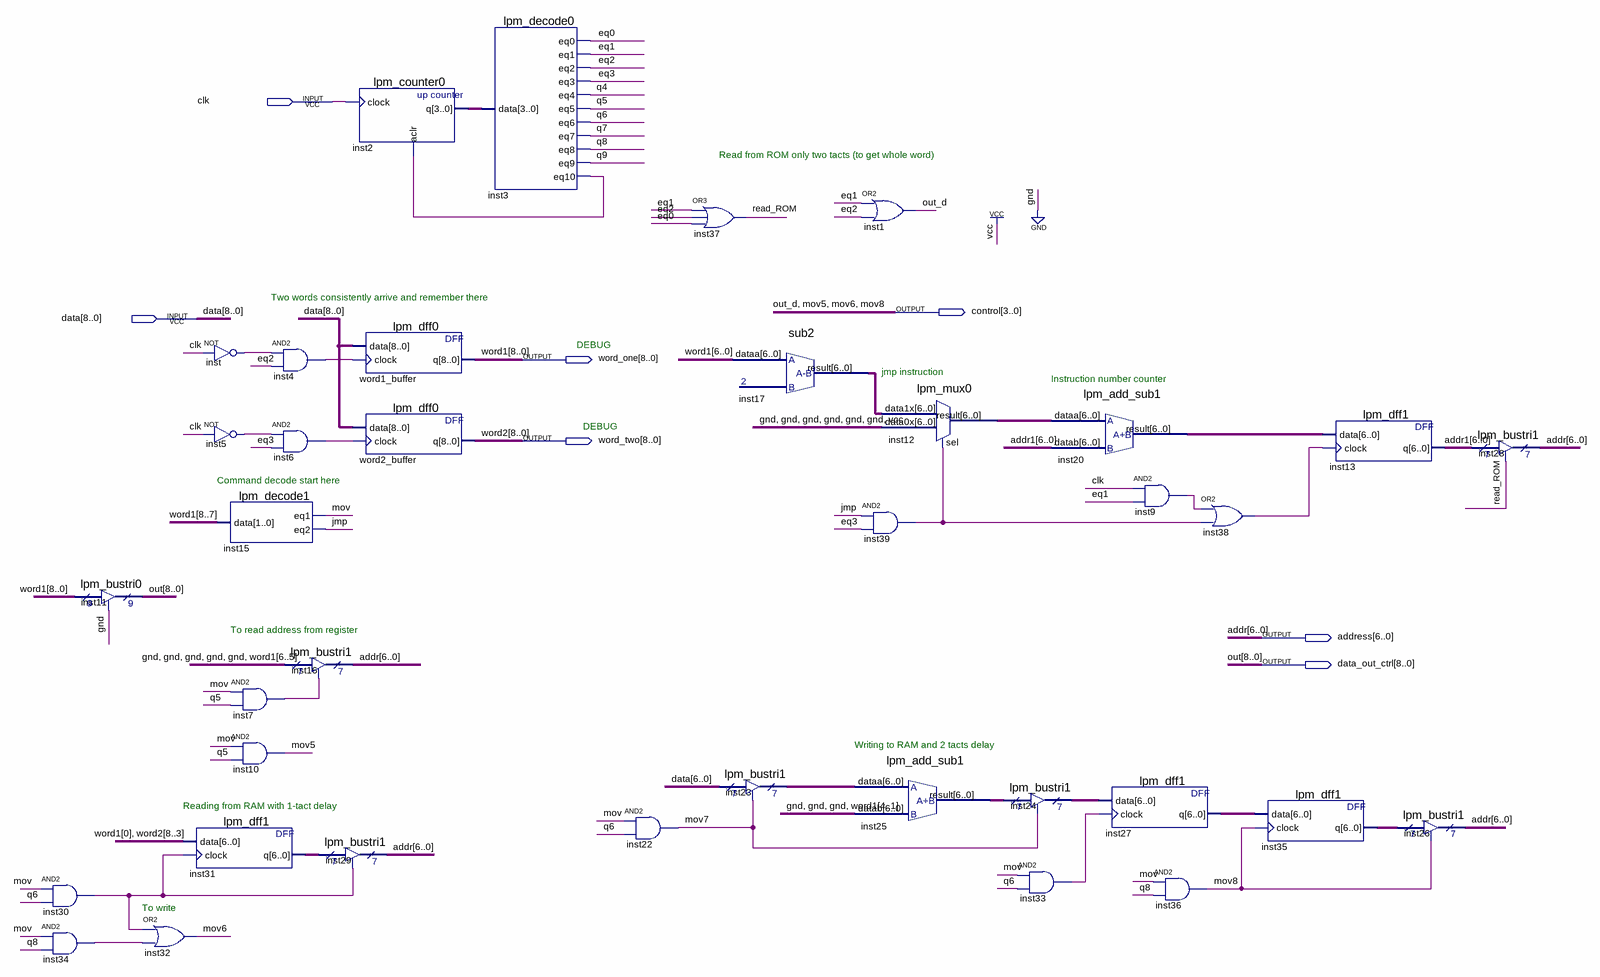
[diagram p0: schematic sheet]
// Quartus schematic control_device.bdf as structural Verilog: 37 symbols, 7 pins
module control_device (
  input  clk,
  input  [8:0] data,
  output [3:0] control,
  output [8:0] word_one,
  output [8:0] word_two,
  output [6:0] address,
  output [8:0] data_out_ctrl
);

  wire eq0, eq1, eq2, eq3, inst3_eq10, inst4_out, inst5_out, inst6_out, inst7_out, inst9_out, inst30_out,
       inst33_out, inst34_out, inst38_out, inst39_out, inst_out, jmp, mov, mov7, q4, q5, q6, q7, q8, q9,
       read_ROM;
  wire [3:0] inst2_q;
  wire [6:0] addr1, inst12_result, inst17_result, inst20_result, inst23_tridata, inst24_tridata,
       inst25_result, inst27_q, inst31_q, inst35_q;

  and inst30 (inst30_out, mov, q6);
  and inst34 (inst34_out, mov, q8);
  lpm_bustri0 inst11 (.enabledt(1'b0), .data(word_one), .tridata(data_out_ctrl));
  or inst32 (control[1], inst30_out, inst34_out);
  not inst (inst_out, clk);
  not inst5 (inst5_out, clk);
  lpm_decode1 inst15 (.data(word_one[8:7]), .eq1(mov), .eq2(jmp));
  lpm_dff1 inst31 (.data({word_one[0], word_two[8:3]}), .clock(inst30_out), .q(inst31_q));
  and inst4 (inst4_out, inst_out, eq2);
  and inst6 (inst6_out, inst5_out, eq3);
  and inst7 (inst7_out, mov, q5);
  and inst10 (control[2], mov, q5);
  lpm_bustri1 inst16 (.enabledt(inst7_out), .data({{5{1'b0}}, word_one[6:5]}), .tridata(address));
  lpm_bustri1 inst29 (.enabledt(inst30_out), .data(inst31_q), .tridata(address));
  lpm_counter0 inst2 (.clock(clk), .aclr(inst3_eq10), .q(inst2_q));
  lpm_dff0 word1_buffer (.data(data), .clock(inst4_out), .q(word_one));
  lpm_dff0 word2_buffer (.data(data), .clock(inst6_out), .q(word_two));
  lpm_decode0 inst3 (
    .data(inst2_q), .eq0(eq0), .eq1(eq1), .eq2(eq2), .eq3(eq3), .eq4(q4), .eq5(q5), .eq6(q6), .eq7(q7),
    .eq8(q8), .eq9(q9), .eq10(inst3_eq10));
  and inst22 (mov7, mov, q6);
  or inst37 (read_ROM, eq1, eq2, eq0);
  sub2 inst17 (.dataa(word_one[6:0]), .result(inst17_result));
  lpm_bustri1 inst23 (.enabledt(mov7), .data(data[6:0]), .tridata(inst23_tridata));
  or inst1 (control[3], eq1, eq2);
  and inst39 (inst39_out, jmp, eq3);
  lpm_add_sub1 inst25 (.dataa(inst23_tridata), .datab({3'b000, word_one[4:1]}), .result(inst25_result));
  lpm_mux0 inst12 (.data1x(inst17_result), .data0x(7'b0000001), .sel(inst39_out), .result(inst12_result));
  lpm_bustri1 inst24 (.enabledt(mov7), .data(inst25_result), .tridata(inst24_tridata));
  and inst33 (inst33_out, mov, q6);
  lpm_add_sub1 inst20 (.dataa(inst12_result), .datab(addr1), .result(inst20_result));
  and inst9 (inst9_out, clk, eq1);
  lpm_dff1 inst27 (.data(inst24_tridata), .clock(inst33_out), .q(inst27_q));
  and inst36 (control[0], mov, q8);
  or inst38 (inst38_out, inst9_out, inst39_out);
  lpm_dff1 inst35 (.data(inst27_q), .clock(control[0]), .q(inst35_q));
  lpm_dff1 inst13 (.data(inst20_result), .clock(inst38_out), .q(addr1));
  lpm_bustri1 inst26 (.enabledt(control[0]), .data(inst35_q), .tridata(address));
  lpm_bustri1 inst28 (.enabledt(read_ROM), .data(addr1), .tridata(address));

  // Other names for the same wires on the sheet: addr[6:0] = address; mov5 = control[2]; mov6 = control[1];
  //   mov8 = control[0]; out[8:0] = data_out_ctrl; out_d = control[3]; word1[8:0] = word_one; word2[8:0] = word_two

  // Notes on the sheet:
  //   Read from ROM only two tacts (to get whole word)
  //   Two words consistently arrive and remember there
  //   DEBUG
  //   jmp instruction
  //   Instruction number counter
  //   DEBUG
  //   Command decode start here
  //   To read address from register
  //   Writing to RAM and 2 tacts delay
  //   Reading from RAM with 1-tact delay
  //   To write
endmodule
